# Altium schematic sheet mcu.SchDoc
size A4
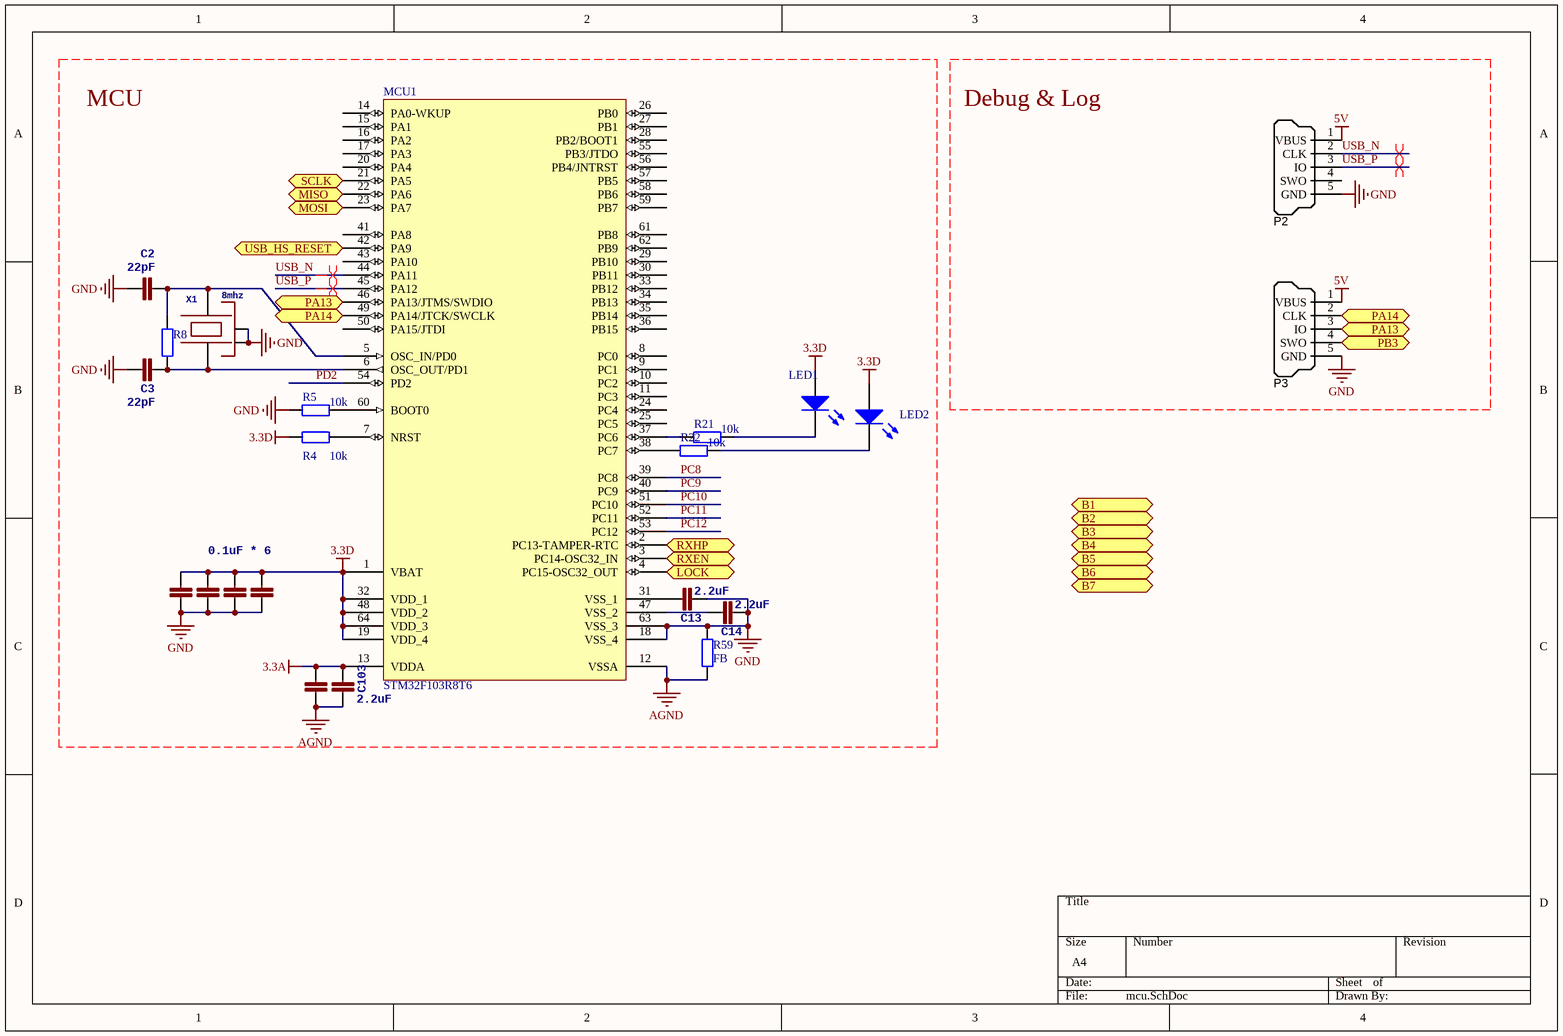
[diagram p0: mcu.SchDoc]

## Parts
C2  22pF  [0402]
C3  22pF  [0402]
C4  0.1uF * 6  [0402]
C5  1n  [0402]  (value not drawn)
C6  1n  [0402]  (value not drawn)
C7  1n  [0402]  (value not drawn)
C13  2.2uF  [0603]
C14  2.2uF  [0603]
C102  1n  [0402]  (value not drawn)
C103  2.2uF  [0603]
LED1  LED0  [0603]  (value not drawn)
LED2  LED0  [0603]  (value not drawn)
MCU1  STM32F103R8T6  [LQFP64_N]
P2  SWD_MicroUSB  [MICRO-YZX]  (value not drawn)
P3  SWD_MicroUSB  [MICRO-YZX]  (value not drawn)
R4  10k  [0402]
R5  10k  [0402]
R8  (no value)  [0402]
R21  10k  [0402]
R22  10k  [0402]
R59  FB  [0402]
X1  8mhz  [OSCILLATOR-3.2X2.5]

## Ports
B1, B2, B3, B4, B5, B6, B7, LOCK, MISO, MOSI, PA13, PA14, PB3, RXEN, RXHP, SCLK, USB_HS_RESET

## Nets
3.3A: C102.2 C103.2 MCU1.13(VDDA)
3.3D: C4.2 C5.2 C6.2 C7.2 LED1.1(A) LED2.1(A) MCU1.1(VBAT) MCU1.19(VDD_4) MCU1.32(VDD_1) MCU1.48(VDD_2) MCU1.64(VDD_3) R4.2
5V: P2.1(VBUS) P3.1(VBUS)
AGND: C102.1 C103.1 MCU1.12(VSSA) R59.2
GND: C2.2 C3.2 C4.1 C5.1 C6.1 C7.1 C13.2 C14.2 MCU1.18(VSS_4) MCU1.63(VSS_3) P2.5(GND) P3.5(GND) R5.1 R59.1 X1.2(NC_2) X1.4(NC_4)
LOCK: MCU1.4(PC15-OSC32_OUT) ; port LOCK
MISO: MCU1.22(PA6) ; port MISO
MOSI: MCU1.23(PA7) ; port MOSI
PA13: MCU1.46(PA13/JTMS/SWDIO) P3.3(IO) ; port PA13
PA14: MCU1.49(PA14/JTCK/SWCLK) P3.2(CLK) ; port PA14
PB3: P3.4(SWO) ; port PB3
PC8: MCU1.39(PC8)
PC9: MCU1.40(PC9)
PC10: MCU1.51(PC10)
PC11: MCU1.52(PC11)
PC12: MCU1.53(PC12)
PD2: MCU1.54(PD2)
RXEN: MCU1.3(PC14-OSC32_IN) ; port RXEN
RXHP: MCU1.2(PC13-TAMPER-RTC) ; port RXHP
SCLK: MCU1.21(PA5) ; port SCLK
USB_HS_RESET: MCU1.42(PA9) ; port USB_HS_RESET
USB_N: MCU1.44(PA11) P2.2(CLK)
USB_P: MCU1.45(PA12) P2.3(IO)
NetC2_1: C2.1 MCU1.5(OSC_IN/PD0) R8.2 X1.3
NetC3_1: C3.1 MCU1.6(OSC_OUT/PD1) R8.1 X1.1
NetC13_1: C13.1 MCU1.31(VSS_1)
NetC14_1: C14.1 MCU1.47(VSS_2)
NetLED1_2: LED1.2(K) R21.2
NetLED2_2: LED2.2(K) R22.2
NetMCU1_7: MCU1.7(NRST) R4.1
NetMCU1_37: MCU1.37(PC6) R21.1
NetMCU1_38: MCU1.38(PC7) R22.1
NetMCU1_60: MCU1.60(BOOT0) R5.2

Not connected (* = marked no-connect by the designer): MCU1 8(PC0) 9(PC1) 10(PC2) 11(PC3) 14(PA0-WKUP) 15(PA1) 16(PA2) 17(PA3) 20(PA4) 24(PC4) 25(PC5) 26(PB0) 27(PB1) 28(PB2/BOOT1) 29(PB10) 30(PB11) 33(PB12) 34(PB13) 35(PB14) 36(PB15) 41(PA8) 43(PA10) 50(PA15/JTDI) 55(PB3/JTDO) 56(PB4/JNTRST) 57(PB5) 58(PB6) 59(PB7) 61(PB8) 62(PB9); P2 4(SWO)

## Layout directives
differential pair: USB_N, USB_P

## Notes on the sheet
- MCU
- Debug & Log

## Library data of the parts
C2-C7 C13 C14 C102 C103 = CAP0402-CAP: <b>Capacitor</b> / Standard 0603 ceramic capacitor, and 0.1" leaded capacitor.; PARTNO: CC0402ZRY5V7BB104
LED1 LED2 = LED0: Typical INFRARED GaAs LED; Published: 8-Jun-2000; LatestRevisionDate: 08-Jul-2005; LatestRevisionNote: Mech Layer 1 removed.; PackageReference: LED-0; Publisher: Altium Limited; PackageDescription: LED; 2 Leads
MCU1 = STM32F103R8T6: STM32 ARM-based 32-bit MCU with 64 Kbytes Flash, 64-pin LQFP, Industrial Temperature; Published: *; DatasheetVersion: *; PackageVersion: *; PackageReference: *; Publisher: *; PackageDescription: *; ComponentLink1Description: *; ComponentLink1URL: *; ComponentLink2Description: *; ComponentLink2URL: *
P2 P3 = SWD_MicroUSB: Connector SMD USB Micro Type B middle mount; Manufacturer 1: Molex Inc; SCDType: undef; Package / Case: SMD; Supplier 1: Digi-Key; Supplier Part Number 1: WM17142CT-ND
R4 R5 R8 R21 R22 R59 = Res2: Resistor; Value: 0Ohm; Published: 8-Jun-2000; LatestRevisionDate: 17-Jul-2002; LatestRevisionNote: Re-released for DXP Platform.; PackageReference: AXIAL-0.4; Publisher: Altium Limited; PackageDescription: Axial Device, Thru-Hole; 2 Leads; 0.4 in Pin Spacing
X1 = OSCILLATOR-3.2X2.5: Crystal Oscillator in 3.2x2.5 SMD